# EAGLE design LM2662 (EAGLE 6.5.0)
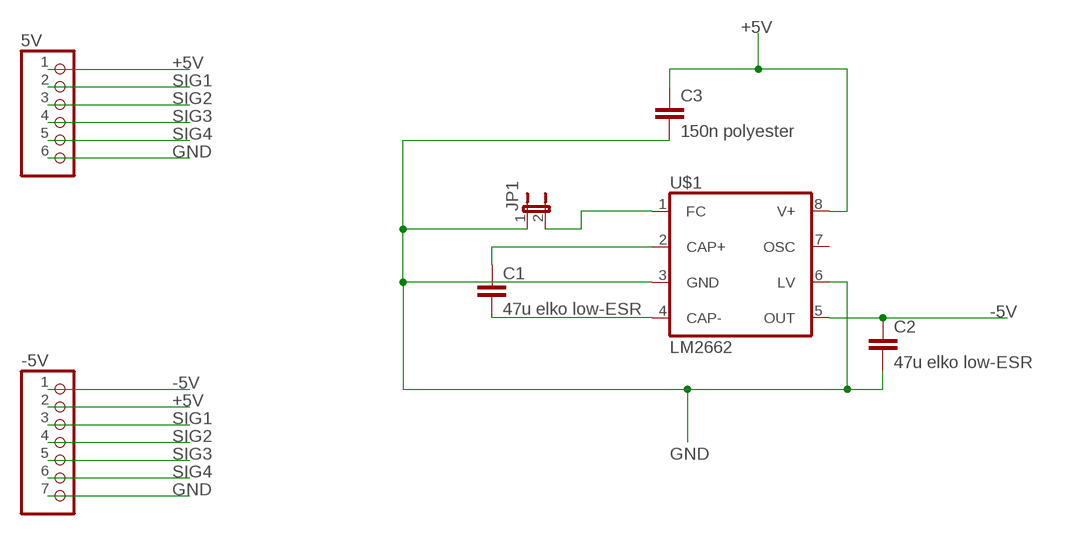
[diagram p0: schematic, sheet 1]

## Parts
5V  PINHD-1X6  [1X06]
-5V  PINHD-1X7  [1X07]
C1  47u elko low-ESR  C-EU025-050X050  [C025-050X050]
C2  47u elko low-ESR  C-EU025-050X050  [C025-050X050]
C3  150n polyester  C-EU050-030X075  [C050-030X075]
JP1  JP1E  [JP1]
U$1  LM2662  [SOIC8]

## Nets
+5V: 5V.1 -5V.2 C3.1 U$1.8(V+)
-5V: -5V.1 C2.1 U$1.5(OUT)
GND: 5V.6 -5V.7 C2.2 C3.2 JP1.1 U$1.3(GND) U$1.6(LV)
N$1: JP1.2 U$1.1(FC)
N$3: C1.1 U$1.2(CAP+)
N$4: C1.2 U$1.4(CAP-)
SIG1: 5V.2 -5V.3
SIG2: 5V.3 -5V.4
SIG3: 5V.4 -5V.5
SIG4: 5V.5 -5V.6
Unconnected: U$1.7(OSC)

## Library data of the parts
5V = pinhead:PINHD-1X6: PIN HEADER
-5V = pinhead:PINHD-1X7: PIN HEADER
C1-C3 = rcl:C-EU: CAPACITOR, European symbol
JP1 = jumper:JP1E: JUMPER
U$1 = custom:LM2662

## Board
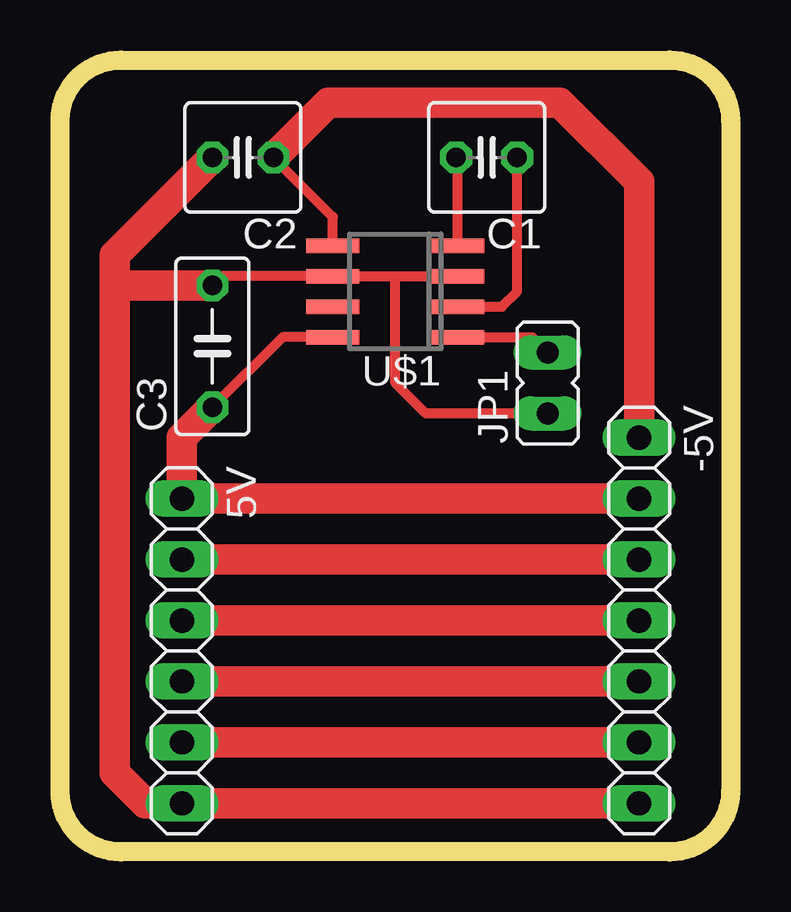
[diagram p1: board, top side]

Size 27.94 x 33.02 mm. Coordinates in mm from the lower left corner, seen from the top.
Outline: 0,2.54 0,30.48 arc-90 2.54,33.02 25.4,33.02 arc-90 27.94,30.48 27.94,2.54 arc-90 25.4,0 2.54,0 arc-90 0,2.54
Copper layers (1*16): Top 0.035mm / dielectric 1.5mm / Bottom 0.035mm
Design rules "default": minimum track width 10mil, minimum drill 24mil, track to track 8mil, track to pad 8mil, pad to pad 8mil, via to via 8mil, smd to smd 8mil, copper to edge 40mil, drill to drill 8mil, minimum pad ring 10mil, minimum via ring 8mil, stop-mask expansion 4mil, vias tented up to drill 0mil, thermal gap 10mil

### Footprints (pad centres in the part's own frame; a part is rotated, then mirrored left to right if it is on the bottom)
1X06 = drill 1.016 long: 1 -6.35,0; 2 -3.81,0; 3 -1.27,0; 4 1.27,0; 5 3.81,0; 6 6.35,0
1X07 = drill 1.016 long: 1 -7.62,0; 2 -5.08,0; 3 -2.54,0; 4 0,0; 5 2.54,0; 6 5.08,0; 7 7.62,0
C025-050X050 = drill 0.813 octagon: 1 -1.27,0; 2 1.27,0
C050-030X075 = drill 0.813 octagon: 1 -2.54,0; 2 2.54,0
JP1 = drill 0.914 long: 1 0,-1.27; 2 0,1.27
SOIC8 = smd 0.6 x 2.2: 1 -1.905,-2.6; 2 -0.635,-2.6; 3 0.635,-2.6; 4 1.905,-2.6; 5 1.905,2.6; 6 0.635,2.6; 7 -0.635,2.6; 8 -1.905,2.6

### Placement (x,y rotation side)
5V  5.08,8.38 270 top
-5V  24.13,9.65 270 top
C1  17.78,28.96 180 top
C2  7.62,28.96 180 top
C3  6.35,21.08 90 top
JP1  20.32,19.56 0 top
U$1  13.97,23.37 90 top

### Tracks (layer width: path | path; a pad name or v marks a point on that pad's centre or on a via)
+5V
  Top 0.406: U$1.8 9.27,21.46 C3.1
  Top 1.27: -5V.2 5V.1 5.08,17.27 C3.1
-5V
  Top 0.406: U$1.5 11.37,26.48 C2.1
  Top 1.27: C2.1 11.18,31.24 20.83,31.24 24.13,27.94 -5V.1
GND
  Top 0.406: 13.97,24 U$1.6 6.73,24 C3.2 | 13.97,24 U$1.3 | JP1.1 15.24,18.29 13.97,19.56 13.97,24
  Top 1.27: -5V.7 5V.6 3.56,2.03 2.29,3.3 2.29,23.88 | 2.29,23.88 2.29,24.89 C2.2 | C3.2 2.54,23.62 2.29,23.88
N$1
  Top 0.406: U$1.1 19.68,21.46 JP1.2
N$3
  Top 0.406: U$1.2 18.41,22.73 19.05,23.37 C1.1
N$4
  Top 0.406: U$1.4 16.57,28.9 C1.2
SIG1
  Top 1.27: 5V.2 -5V.3
SIG2
  Top 1.27: 5V.3 -5V.4
SIG3
  Top 1.27: -5V.5 5V.4
SIG4
  Top 1.27: 5V.5 -5V.6